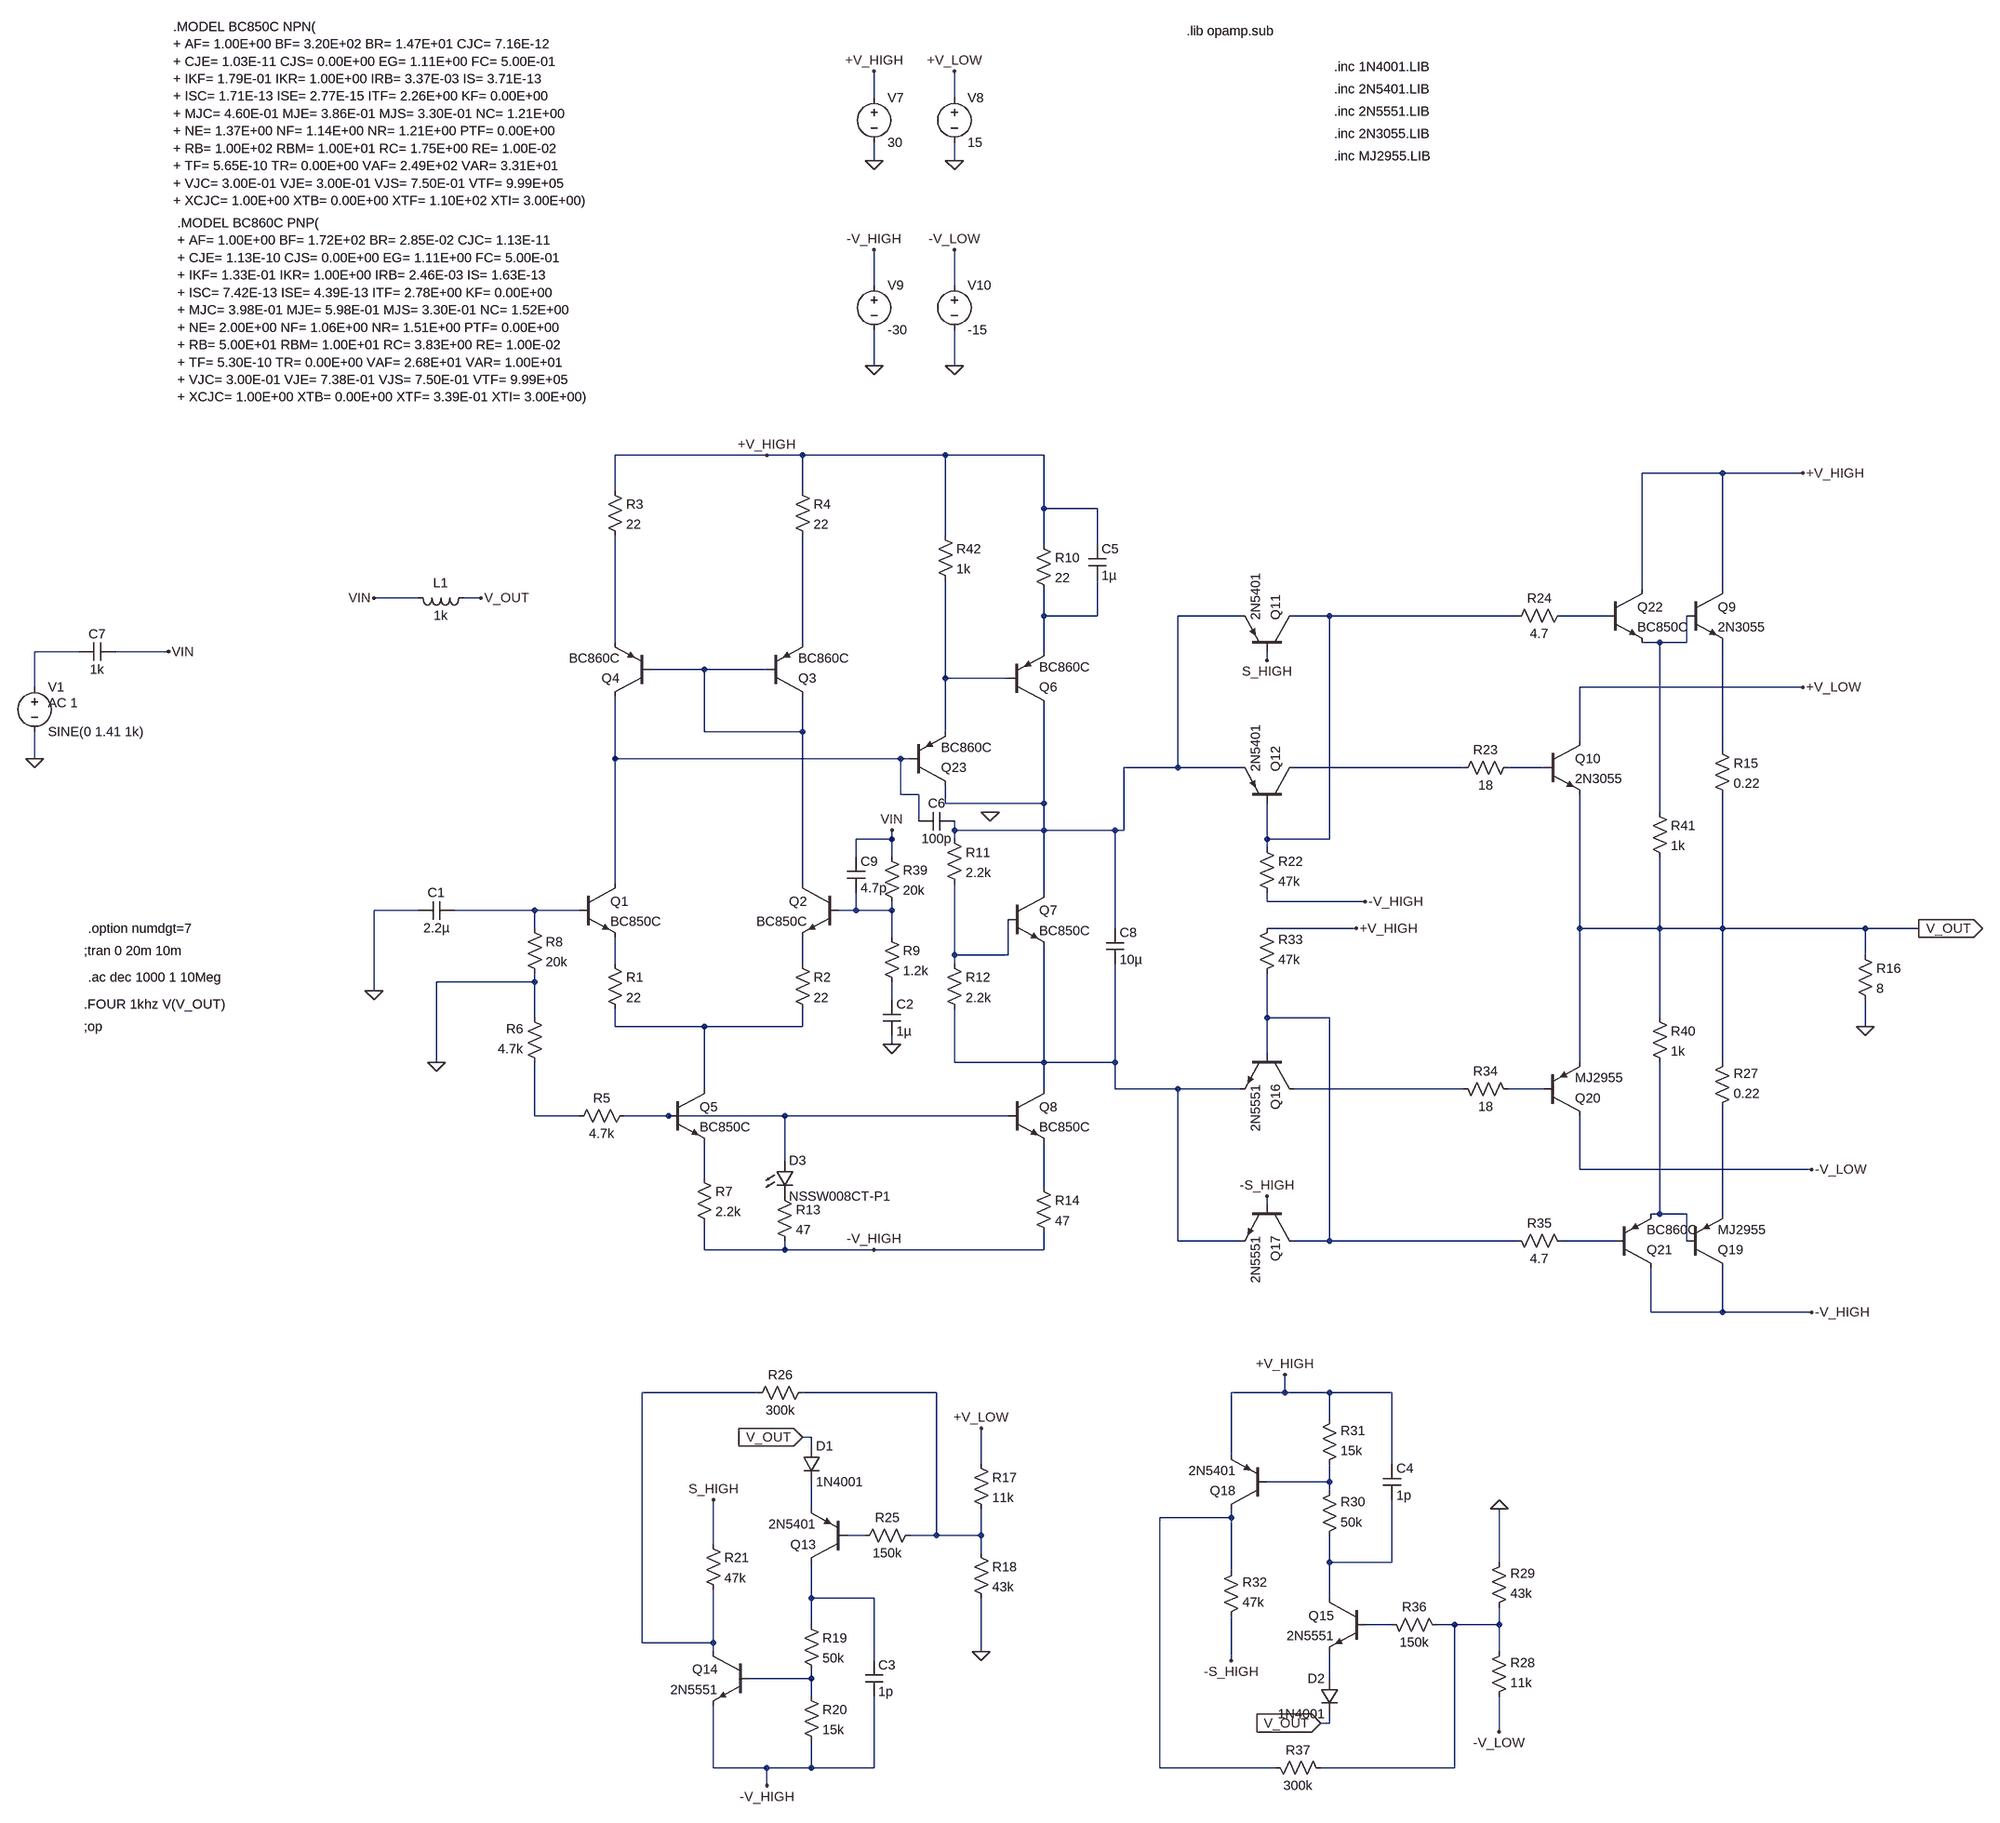
[diagram p0: schematic analisis_compensacion.asc]
analisis_compensacion.asc, the LTspice schematic file:
Version 4
SHEET 1 4340 2796
WIRE 512 -1264 512 -1312
WIRE 656 -1264 656 -1312
WIRE 512 -1152 512 -1184
WIRE 656 -1152 656 -1184
WIRE 512 -928 512 -992
WIRE 656 -928 656 -992
WIRE 512 -784 512 -848
WIRE 656 -784 656 -848
WIRE 320 -624 48 -624
WIRE 384 -624 320 -624
WIRE 640 -624 384 -624
WIRE 816 -624 640 -624
WIRE 2032 -592 1888 -592
WIRE 2176 -592 2032 -592
WIRE 48 -560 48 -624
WIRE 384 -560 384 -624
WIRE 816 -528 816 -624
WIRE 912 -528 816 -528
WIRE 640 -480 640 -624
WIRE 816 -464 816 -528
WIRE 912 -464 912 -528
WIRE 1888 -384 1888 -592
WIRE 2032 -384 2032 -592
WIRE -304 -368 -384 -368
WIRE -192 -368 -224 -368
WIRE 816 -336 816 -384
WIRE 912 -336 912 -400
WIRE 912 -336 816 -336
WIRE 1168 -336 1056 -336
WIRE 1328 -336 1264 -336
WIRE 1664 -336 1328 -336
WIRE 1824 -336 1744 -336
WIRE 48 -288 48 -480
WIRE 384 -288 384 -480
WIRE 1920 -288 1888 -288
WIRE 1968 -288 1968 -336
WIRE 1968 -288 1920 -288
WIRE -912 -272 -992 -272
WIRE -752 -272 -848 -272
WIRE 816 -272 816 -336
WIRE 1216 -256 1216 -272
WIRE 208 -240 112 -240
WIRE 320 -240 208 -240
WIRE 640 -224 640 -400
WIRE 752 -224 640 -224
WIRE -992 -208 -992 -272
WIRE 2176 -208 1776 -208
WIRE 208 -128 208 -240
WIRE 384 -128 384 -192
WIRE 384 -128 208 -128
WIRE 640 -128 640 -224
WIRE 1776 -112 1776 -208
WIRE 2032 -96 2032 -288
WIRE -992 -80 -992 -128
WIRE 48 -80 48 -192
WIRE 560 -80 48 -80
WIRE 576 -80 560 -80
WIRE 1056 -64 1056 -336
WIRE 1056 -64 960 -64
WIRE 1168 -64 1056 -64
WIRE 1568 -64 1264 -64
WIRE 1712 -64 1648 -64
WIRE 560 -16 560 -80
WIRE 592 -16 560 -16
WIRE 640 0 640 -32
WIRE 816 0 816 -176
WIRE 816 0 640 0
WIRE 1920 16 1920 -288
WIRE 592 32 592 -16
WIRE 656 48 656 32
WIRE 816 48 816 0
WIRE 816 48 656 48
WIRE 944 48 816 48
WIRE 960 48 960 -64
WIRE 960 48 944 48
WIRE 544 64 544 48
WIRE 544 64 480 64
WIRE 656 64 656 48
WIRE 1216 64 1216 0
WIRE 1328 64 1328 -336
WIRE 1328 64 1216 64
WIRE 1216 80 1216 64
WIRE 480 96 480 64
WIRE 544 96 544 64
WIRE 48 144 48 -80
WIRE 384 144 384 -128
WIRE 816 160 816 48
WIRE 1216 176 1216 160
WIRE 1392 176 1216 176
WIRE -304 192 -384 192
WIRE -96 192 -240 192
WIRE -16 192 -96 192
WIRE 480 192 480 160
WIRE 480 192 448 192
WIRE 544 192 544 176
WIRE 544 192 480 192
WIRE -96 224 -96 192
WIRE 944 224 944 48
WIRE 1376 224 1216 224
WIRE 1776 224 1776 -16
WIRE 1920 224 1920 96
WIRE 1920 224 1776 224
WIRE 2032 224 2032 -16
WIRE 2032 224 1920 224
WIRE 2288 224 2032 224
WIRE 2384 224 2288 224
WIRE 544 240 544 192
WIRE 656 272 656 144
WIRE 752 272 752 208
WIRE 752 272 656 272
WIRE 2288 272 2288 224
WIRE 48 288 48 240
WIRE 384 288 384 240
WIRE 656 288 656 272
WIRE -96 320 -96 304
WIRE -96 320 -272 320
WIRE -384 336 -384 192
WIRE 544 352 544 320
WIRE -96 384 -96 320
WIRE 1216 384 1216 304
WIRE 1328 384 1216 384
WIRE 1920 384 1920 224
WIRE 48 400 48 368
WIRE 208 400 48 400
WIRE 384 400 384 368
WIRE 384 400 208 400
WIRE 2288 400 2288 352
WIRE 544 432 544 416
WIRE 1216 448 1216 384
WIRE -272 464 -272 320
WIRE 656 464 656 368
WIRE 816 464 816 256
WIRE 816 464 656 464
WIRE 944 464 944 288
WIRE 944 464 816 464
WIRE 1776 464 1776 224
WIRE 2032 464 2032 224
WIRE 208 512 208 400
WIRE 816 512 816 464
WIRE 944 512 944 464
WIRE 1056 512 944 512
WIRE 1168 512 1056 512
WIRE 1568 512 1264 512
WIRE 1712 512 1648 512
WIRE -96 560 -96 464
WIRE -16 560 -96 560
WIRE 144 560 64 560
WIRE 352 560 144 560
WIRE 752 560 352 560
WIRE 352 640 352 560
WIRE 1776 656 1776 560
WIRE 2192 656 1776 656
WIRE 208 672 208 608
WIRE 816 688 816 608
WIRE 1216 720 1216 704
WIRE 1920 736 1920 464
WIRE 1920 736 1904 736
WIRE 1968 736 1920 736
WIRE 2032 736 2032 544
WIRE 1056 784 1056 512
WIRE 1168 784 1056 784
WIRE 1328 784 1328 384
WIRE 1328 784 1264 784
WIRE 1664 784 1328 784
WIRE 1840 784 1744 784
WIRE 1968 784 1968 736
WIRE 208 800 208 752
WIRE 352 800 352 784
WIRE 352 800 208 800
WIRE 512 800 352 800
WIRE 816 800 816 768
WIRE 816 800 512 800
WIRE 1904 912 1904 832
WIRE 2032 912 2032 832
WIRE 2032 912 1904 912
WIRE 2192 912 2032 912
WIRE 304 1056 96 1056
WIRE 624 1056 384 1056
WIRE 1248 1056 1248 1024
WIRE 1248 1056 1152 1056
WIRE 1328 1056 1248 1056
WIRE 1440 1056 1328 1056
WIRE 1328 1104 1328 1056
WIRE 400 1136 384 1136
WIRE 400 1152 400 1136
WIRE 1152 1168 1152 1056
WIRE 704 1184 704 1120
WIRE 1440 1184 1440 1056
WIRE 1328 1216 1328 1184
WIRE 1328 1216 1216 1216
WIRE 1328 1232 1328 1216
WIRE 400 1264 400 1216
WIRE 1152 1280 1152 1264
WIRE 1152 1280 1024 1280
WIRE 496 1312 464 1312
WIRE 624 1312 624 1056
WIRE 624 1312 576 1312
WIRE 704 1312 704 1264
WIRE 704 1312 624 1312
WIRE 224 1328 224 1248
WIRE 704 1344 704 1312
WIRE 1328 1360 1328 1312
WIRE 1440 1360 1440 1248
WIRE 1440 1360 1328 1360
WIRE 1632 1360 1632 1264
WIRE 1152 1376 1152 1280
WIRE 400 1424 400 1360
WIRE 512 1424 400 1424
WIRE 1328 1424 1328 1360
WIRE 400 1472 400 1424
WIRE 1440 1472 1392 1472
WIRE 1552 1472 1520 1472
WIRE 1632 1472 1632 1440
WIRE 1632 1472 1552 1472
WIRE 96 1504 96 1056
WIRE 224 1504 224 1408
WIRE 224 1504 96 1504
WIRE 224 1520 224 1504
WIRE 704 1520 704 1424
WIRE 1632 1520 1632 1472
WIRE 512 1536 512 1424
WIRE 1152 1536 1152 1456
WIRE 400 1568 400 1552
WIRE 400 1568 288 1568
WIRE 1328 1568 1328 1520
WIRE 400 1600 400 1568
WIRE 1328 1648 1328 1632
WIRE 1328 1648 1312 1648
WIRE 1632 1664 1632 1600
WIRE 224 1728 224 1616
WIRE 320 1728 224 1728
WIRE 400 1728 400 1680
WIRE 400 1728 320 1728
WIRE 512 1728 512 1600
WIRE 512 1728 400 1728
WIRE 1024 1728 1024 1280
WIRE 1232 1728 1024 1728
WIRE 1552 1728 1552 1472
WIRE 1552 1728 1312 1728
WIRE 320 1760 320 1728
FLAG -272 464 0
FLAG 544 432 0
FLAG -384 336 0
FLAG 2176 -592 +V_HIGH
FLAG 2176 -208 +V_LOW
FLAG 2288 400 0
FLAG 704 1520 0
FLAG 704 1120 +V_LOW
FLAG 2384 224 V_OUT
IOPIN 2384 224 Out
FLAG 384 1136 V_OUT
IOPIN 384 1136 In
FLAG 320 1760 -V_HIGH
FLAG 1216 -256 S_HIGH
FLAG 224 1248 S_HIGH
FLAG 1392 176 -V_HIGH
FLAG 2192 912 -V_HIGH
FLAG 2192 656 -V_LOW
FLAG 1632 1264 0
FLAG 1632 1664 -V_LOW
FLAG 1312 1648 V_OUT
IOPIN 1312 1648 In
FLAG 1248 1024 +V_HIGH
FLAG 1216 704 -S_HIGH
FLAG 1152 1536 -S_HIGH
FLAG 1376 224 +V_HIGH
FLAG 512 -1152 0
FLAG 656 -1152 0
FLAG 512 -1312 +V_HIGH
FLAG 656 -1312 +V_LOW
FLAG 512 -784 0
FLAG 656 -784 0
FLAG 512 -992 -V_HIGH
FLAG 656 -992 -V_LOW
FLAG 320 -624 +V_HIGH
FLAG 512 800 -V_HIGH
FLAG 720 16 0
FLAG 544 48 VIN
FLAG -384 -368 VIN
FLAG -192 -368 V_OUT
FLAG -752 -272 VIN
FLAG -992 -80 0
DATAFLAG 2288 224 ""
SYMBOL npn -16 144 R0
SYMATTR InstName Q1
SYMATTR Value BC850C
SYMBOL npn 448 144 M0
SYMATTR InstName Q2
SYMATTR Value BC850C
SYMBOL pnp 320 -192 M180
SYMATTR InstName Q3
SYMATTR Value BC860C
SYMBOL pnp 112 -192 R180
SYMATTR InstName Q4
SYMATTR Value BC860C
SYMBOL res 32 272 R0
SYMATTR InstName R1
SYMATTR Value 22
SYMBOL res 368 272 R0
SYMATTR InstName R2
SYMATTR Value 22
SYMBOL res 32 -576 R0
SYMATTR InstName R3
SYMATTR Value 22
SYMBOL res 368 -576 R0
SYMATTR InstName R4
SYMATTR Value 22
SYMBOL npn 144 512 R0
SYMATTR InstName Q5
SYMATTR Value BC850C
SYMBOL res 80 544 R90
WINDOW 0 0 56 VBottom 2
WINDOW 3 32 56 VTop 2
SYMATTR InstName R5
SYMATTR Value 4.7k
SYMBOL res -80 480 R180
WINDOW 0 36 76 Left 2
WINDOW 3 36 40 Left 2
SYMATTR InstName R6
SYMATTR Value 4.7k
SYMBOL res 192 656 R0
SYMATTR InstName R7
SYMATTR Value 2.2k
SYMBOL res -112 208 R0
SYMATTR InstName R8
SYMATTR Value 20k
SYMBOL res 528 224 R0
SYMATTR InstName R9
SYMATTR Value 1.2k
SYMBOL cap -240 176 R90
WINDOW 0 0 32 VBottom 2
WINDOW 3 32 32 VTop 2
SYMATTR InstName C1
SYMATTR Value 2.2µ
SYMBOL pnp 752 -176 M180
SYMATTR InstName Q6
SYMATTR Value BC860C
SYMBOL res 800 -480 R0
SYMATTR InstName R10
SYMATTR Value 22
SYMBOL npn 752 160 R0
SYMATTR InstName Q7
SYMATTR Value BC850C
SYMBOL res 640 48 R0
SYMATTR InstName R11
SYMATTR Value 2.2k
SYMBOL res 640 272 R0
SYMATTR InstName R12
SYMATTR Value 2.2k
SYMBOL npn 752 512 R0
SYMATTR InstName Q8
SYMATTR Value BC850C
SYMBOL res 800 672 R0
SYMATTR InstName R14
SYMATTR Value 47
SYMBOL cap 528 352 R0
SYMATTR InstName C2
SYMATTR Value 1µ
SYMBOL npn 1968 -384 R0
SYMATTR InstName Q9
SYMATTR Value 2N3055
SYMBOL npn 1712 -112 R0
SYMATTR InstName Q10
SYMATTR Value 2N3055
SYMBOL res 2016 -112 R0
SYMATTR InstName R15
SYMATTR Value 0.22
SYMBOL pnp 1264 -272 M270
SYMATTR InstName Q11
SYMATTR Value 2N5401
SYMBOL pnp 1264 0 M270
SYMATTR InstName Q12
SYMATTR Value 2N5401
SYMBOL res 2272 256 R0
SYMATTR InstName R16
SYMATTR Value 8
SYMBOL res 688 1168 R0
SYMATTR InstName R17
SYMATTR Value 11k
SYMBOL res 688 1328 R0
SYMATTR InstName R18
SYMATTR Value 43k
SYMBOL pnp 464 1360 R180
SYMATTR InstName Q13
SYMATTR Value 2N5401
SYMBOL res 384 1456 R0
SYMATTR InstName R19
SYMATTR Value 50k
SYMBOL res 384 1584 R0
SYMATTR InstName R20
SYMATTR Value 15k
SYMBOL npn 288 1520 M0
SYMATTR InstName Q14
SYMATTR Value 2N5551
SYMBOL res 208 1312 R0
SYMATTR InstName R21
SYMATTR Value 47k
SYMBOL res 1200 64 R0
SYMATTR InstName R22
SYMATTR Value 47k
SYMBOL cap 496 1536 R0
SYMATTR InstName C3
SYMATTR Value 1p
SYMBOL diode 384 1152 R0
SYMATTR InstName D1
SYMATTR Value 1N4001
SYMBOL res 1664 -80 R90
WINDOW 0 0 56 VBottom 2
WINDOW 3 32 56 VTop 2
SYMATTR InstName R23
SYMATTR Value 18
SYMBOL res 1760 -352 R90
WINDOW 0 0 56 VBottom 2
WINDOW 3 32 56 VTop 2
SYMATTR InstName R24
SYMATTR Value 4.7
SYMBOL res 592 1296 R90
WINDOW 0 0 56 VBottom 2
WINDOW 3 32 56 VTop 2
SYMATTR InstName R25
SYMATTR Value 150k
SYMBOL res 400 1040 R90
WINDOW 0 0 56 VBottom 2
WINDOW 3 32 56 VTop 2
SYMATTR InstName R26
SYMATTR Value 300k
SYMBOL res 2016 560 M180
WINDOW 0 36 76 Left 2
WINDOW 3 36 40 Left 2
SYMATTR InstName R27
SYMATTR Value 0.22
SYMBOL res 1616 1616 M180
WINDOW 0 36 76 Left 2
WINDOW 3 36 40 Left 2
SYMATTR InstName R28
SYMATTR Value 11k
SYMBOL res 1616 1456 M180
WINDOW 0 36 76 Left 2
WINDOW 3 36 40 Left 2
SYMATTR InstName R29
SYMATTR Value 43k
SYMBOL res 1312 1328 M180
WINDOW 0 36 76 Left 2
WINDOW 3 36 40 Left 2
SYMATTR InstName R30
SYMATTR Value 50k
SYMBOL res 1312 1200 M180
WINDOW 0 36 76 Left 2
WINDOW 3 36 40 Left 2
SYMATTR InstName R31
SYMATTR Value 15k
SYMBOL res 1136 1472 M180
WINDOW 0 36 76 Left 2
WINDOW 3 36 40 Left 2
SYMATTR InstName R32
SYMATTR Value 47k
SYMBOL res 1200 320 M180
WINDOW 0 36 76 Left 2
WINDOW 3 36 40 Left 2
SYMATTR InstName R33
SYMATTR Value 47k
SYMBOL cap 1424 1248 M180
WINDOW 0 24 56 Left 2
WINDOW 3 24 8 Left 2
SYMATTR InstName C4
SYMATTR Value 1p
SYMBOL diode 1344 1568 M0
SYMATTR InstName D2
SYMATTR Value 1N4001
SYMBOL res 1664 528 M270
WINDOW 0 32 56 VTop 2
WINDOW 3 0 56 VBottom 2
SYMATTR InstName R34
SYMATTR Value 18
SYMBOL res 1760 800 M270
WINDOW 0 32 56 VTop 2
WINDOW 3 0 56 VBottom 2
SYMATTR InstName R35
SYMATTR Value 4.7
SYMBOL res 1536 1488 M270
WINDOW 0 32 56 VTop 2
WINDOW 3 0 56 VBottom 2
SYMATTR InstName R36
SYMATTR Value 150k
SYMBOL res 1328 1744 M270
WINDOW 0 32 56 VTop 2
WINDOW 3 0 56 VBottom 2
SYMATTR InstName R37
SYMATTR Value 300k
SYMBOL npn 1392 1424 M0
SYMATTR InstName Q15
SYMATTR Value 2N5551
SYMBOL npn 1264 448 R90
SYMATTR InstName Q16
SYMATTR Value 2N5551
SYMBOL npn 1264 720 R90
SYMATTR InstName Q17
SYMATTR Value 2N5551
SYMBOL pnp 1216 1264 R180
SYMATTR InstName Q18
SYMATTR Value 2N5401
SYMBOL pnp 1968 832 M180
SYMATTR InstName Q19
SYMATTR Value MJ2955
SYMBOL pnp 1712 560 M180
SYMATTR InstName Q20
SYMATTR Value MJ2955
SYMBOL voltage 512 -1280 R0
WINDOW 123 0 0 Left 0
WINDOW 39 0 0 Left 0
SYMATTR InstName V7
SYMATTR Value 30
SYMBOL voltage 656 -1280 R0
WINDOW 123 0 0 Left 0
WINDOW 39 0 0 Left 0
SYMATTR InstName V8
SYMATTR Value 15
SYMBOL voltage 512 -944 R0
WINDOW 123 0 0 Left 0
WINDOW 39 0 0 Left 0
SYMATTR InstName V9
SYMATTR Value -30
SYMBOL voltage 656 -944 R0
WINDOW 123 0 0 Left 0
WINDOW 39 0 0 Left 0
SYMATTR InstName V10
SYMATTR Value -15
SYMBOL res 528 80 R0
SYMATTR InstName R39
SYMATTR Value 20k
SYMBOL LED 336 640 R0
SYMATTR InstName D3
SYMATTR Value NSSW008CT-P1
SYMBOL cap 896 -464 R0
SYMATTR InstName C5
SYMATTR Value 1µ
SYMBOL pnp 1840 832 M180
SYMATTR InstName Q21
SYMATTR Value BC860C
SYMBOL res 1904 368 R0
SYMATTR InstName R40
SYMATTR Value 1k
SYMBOL npn 1824 -384 R0
SYMATTR InstName Q22
SYMATTR Value BC850C
SYMBOL res 1904 0 R0
SYMATTR InstName R41
SYMATTR Value 1k
SYMBOL res 336 688 R0
SYMATTR InstName R13
SYMATTR Value 47
SYMBOL pnp 576 -32 M180
SYMATTR InstName Q23
SYMATTR Value BC860C
SYMBOL res 624 -496 R0
SYMATTR InstName R42
SYMATTR Value 1k
SYMBOL cap 656 16 R90
WINDOW 0 0 32 VBottom 2
WINDOW 3 32 32 VTop 2
SYMATTR InstName C6
SYMATTR Value 100p
SYMBOL cap 928 224 R0
SYMATTR InstName C8
SYMATTR Value 10µ
SYMBOL ind -208 -384 R90
WINDOW 0 5 56 VBottom 2
WINDOW 3 32 56 VTop 2
SYMATTR InstName L1
SYMATTR Value 1k
SYMBOL voltage -992 -224 R0
WINDOW 123 24 44 Left 2
WINDOW 39 0 0 Left 0
SYMATTR InstName V1
SYMATTR Value SINE(0 1.41 1k)
SYMATTR Value2 AC 1
SYMBOL cap -848 -288 R90
WINDOW 0 0 32 VBottom 2
WINDOW 3 32 32 VTop 2
SYMATTR InstName C7
SYMATTR Value 1k
SYMBOL cap 464 96 R0
SYMATTR InstName C9
SYMATTR Value 4.7p
TEXT -904 264 Left 2 !;tran 0 20m 10m
TEXT -904 360 Left 2 !.FOUR 1khz V(V_OUT)
TEXT 1336 -1160 Left 2 !.inc MJ2955.LIB
TEXT 1336 -1200 Left 2 !.inc 2N3055.LIB
TEXT 1336 -1240 Left 2 !.inc 2N5551.LIB
TEXT 1336 -1280 Left 2 !.inc 2N5401.LIB
TEXT 1336 -1320 Left 2 !.inc 1N4001.LIB
TEXT -744 -1392 Left 2 !.MODEL BC850C NPN(\n+ AF= 1.00E+00 BF= 3.20E+02 BR= 1.47E+01 CJC= 7.16E-12\n+ CJE= 1.03E-11 CJS= 0.00E+00 EG= 1.11E+00 FC= 5.00E-01\n+ IKF= 1.79E-01 IKR= 1.00E+00 IRB= 3.37E-03 IS= 3.71E-13\n+ ISC= 1.71E-13 ISE= 2.77E-15 ITF= 2.26E+00 KF= 0.00E+00\n+ MJC= 4.60E-01 MJE= 3.86E-01 MJS= 3.30E-01 NC= 1.21E+00\n+ NE= 1.37E+00 NF= 1.14E+00 NR= 1.21E+00 PTF= 0.00E+00\n+ RB= 1.00E+02 RBM= 1.00E+01 RC= 1.75E+00 RE= 1.00E-02\n+ TF= 5.65E-10 TR= 0.00E+00 VAF= 2.49E+02 VAR= 3.31E+01\n+ VJC= 3.00E-01 VJE= 3.00E-01 VJS= 7.50E-01 VTF= 9.99E+05\n+ XCJC= 1.00E+00 XTB= 0.00E+00 XTF= 1.10E+02 XTI= 3.00E+00)
TEXT -736 -1040 Left 2 !.MODEL BC860C PNP(\n+ AF= 1.00E+00 BF= 1.72E+02 BR= 2.85E-02 CJC= 1.13E-11\n+ CJE= 1.13E-10 CJS= 0.00E+00 EG= 1.11E+00 FC= 5.00E-01\n+ IKF= 1.33E-01 IKR= 1.00E+00 IRB= 2.46E-03 IS= 1.63E-13\n+ ISC= 7.42E-13 ISE= 4.39E-13 ITF= 2.78E+00 KF= 0.00E+00\n+ MJC= 3.98E-01 MJE= 5.98E-01 MJS= 3.30E-01 NC= 1.52E+00\n+ NE= 2.00E+00 NF= 1.06E+00 NR= 1.51E+00 PTF= 0.00E+00\n+ RB= 5.00E+01 RBM= 1.00E+01 RC= 3.83E+00 RE= 1.00E-02\n+ TF= 5.30E-10 TR= 0.00E+00 VAF= 2.68E+01 VAR= 1.00E+01\n+ VJC= 3.00E-01 VJE= 7.38E-01 VJS= 7.50E-01 VTF= 9.99E+05\n+ XCJC= 1.00E+00 XTB= 0.00E+00 XTF= 3.39E-01 XTI= 3.00E+00)
TEXT 1072 -1384 Left 2 !.lib opamp.sub
TEXT -896 312 Left 2 !.ac dec 1000 1 10Meg
TEXT -904 400 Left 2 !;op
TEXT -896 224 Left 2 !.option numdgt=7

The netlist it stands for:
* analisis_compensacion.asc
Q1 N012 N015 N018 0 BC850C
Q2 N009 N016 N019 0 BC850C
Q3 N009 N009 N006 0 BC860C
Q4 N012 N009 N005 0 BC860C
R1 N018 N022 22
R2 N019 N022 22
R3 +V_HIGH N005 22
R4 +V_HIGH N006 22
Q5 N022 N027 N028 0 BC850C
R5 N027 N026 4.7k
R6 N026 0 4.7k
R7 N028 -V_HIGH 2.2k
R8 N015 0 20k
R9 N016 N020 1.2k
C1 N015 0 2.2µ
Q6 N002 N010 N001 0 BC860C
R10 +V_HIGH N001 22
Q7 N002 N017 N023 0 BC850C
R11 N002 N017 2.2k
R12 N017 N023 2.2k
Q8 N023 N027 N029 0 BC850C
R14 N029 -V_HIGH 47
C2 N020 0 1µ
Q9 +V_HIGH N007 N011 0 2N3055
Q10 +V_LOW N014 V_OUT 0 2N3055
R15 N011 V_OUT 0.22
Q11 N003 S_HIGH N002 0 2N5401
Q12 N013 N003 N002 0 2N5401
R16 V_OUT 0 8
R17 +V_LOW N034 11k
R18 N034 0 43k
Q13 N040 N038 N036 0 2N5401
R19 N040 N043 50k
R20 N043 -V_HIGH 15k
Q14 N033 N043 -V_HIGH 0 2N5551
R21 S_HIGH N033 47k
R22 N003 -V_HIGH 47k
C3 N040 -V_HIGH 1p
D1 V_OUT N036 1N4001
R23 N014 N013 18
R24 N004 N003 4.7
R25 N034 N038 150k
R26 N034 N033 300k
R27 N031 V_OUT 0.22
R28 -V_LOW N042 11k
R29 N042 0 43k
R30 N039 N035 50k
R31 N035 +V_HIGH 15k
R32 -S_HIGH N037 47k
R33 N021 +V_HIGH 47k
C4 N039 +V_HIGH 1p
D2 N044 V_OUT 1N4001
R34 N025 N024 18
R35 N032 N021 4.7
R36 N042 N041 150k
R37 N042 N037 300k
Q15 N039 N041 N044 0 2N5551
Q16 N024 N021 N023 0 2N5551
Q17 N021 -S_HIGH N023 0 2N5551
Q18 N037 N035 +V_HIGH 0 2N5401
Q19 -V_HIGH N030 N031 0 MJ2955
Q20 -V_LOW N025 V_OUT 0 MJ2955
V7 +V_HIGH 0 30
V8 +V_LOW 0 15
V9 -V_HIGH 0 -30
V10 -V_LOW 0 -15
R39 VIN N016 20k
D3 N027 P001 NSSW008CT-P1
C5 +V_HIGH N001 1µ
Q21 -V_HIGH N032 N030 0 BC860C
R40 V_OUT N030 1k
Q22 +V_HIGH N004 N007 0 BC850C
R41 N007 V_OUT 1k
R13 P001 -V_HIGH 47
Q23 N002 N012 N010 0 BC860C
R42 +V_HIGH N010 1k
C6 N002 N012 100p
C8 N002 N023 10µ
L1 V_OUT VIN 1k
V1 N008 0 SINE(0 1.41 1k) AC 1
C7 VIN N008 1k
C9 VIN N016 4.7p
.model D D
.lib standard.dio
.model NPN NPN
.model PNP PNP
.lib standard.bjt
;tran 0 20m 10m
.FOUR 1khz V(V_OUT)
.inc MJ2955.LIB
.inc 2N3055.LIB
.inc 2N5551.LIB
.inc 2N5401.LIB
.inc 1N4001.LIB
.MODEL BC850C NPN(
+ AF= 1.00E+00 BF= 3.20E+02 BR= 1.47E+01 CJC= 7.16E-12
+ CJE= 1.03E-11 CJS= 0.00E+00 EG= 1.11E+00 FC= 5.00E-01
+ IKF= 1.79E-01 IKR= 1.00E+00 IRB= 3.37E-03 IS= 3.71E-13
+ ISC= 1.71E-13 ISE= 2.77E-15 ITF= 2.26E+00 KF= 0.00E+00
+ MJC= 4.60E-01 MJE= 3.86E-01 MJS= 3.30E-01 NC= 1.21E+00
+ NE= 1.37E+00 NF= 1.14E+00 NR= 1.21E+00 PTF= 0.00E+00
+ RB= 1.00E+02 RBM= 1.00E+01 RC= 1.75E+00 RE= 1.00E-02
+ TF= 5.65E-10 TR= 0.00E+00 VAF= 2.49E+02 VAR= 3.31E+01
+ VJC= 3.00E-01 VJE= 3.00E-01 VJS= 7.50E-01 VTF= 9.99E+05
+ XCJC= 1.00E+00 XTB= 0.00E+00 XTF= 1.10E+02 XTI= 3.00E+00)
.MODEL BC860C PNP(
+ AF= 1.00E+00 BF= 1.72E+02 BR= 2.85E-02 CJC= 1.13E-11
+ CJE= 1.13E-10 CJS= 0.00E+00 EG= 1.11E+00 FC= 5.00E-01
+ IKF= 1.33E-01 IKR= 1.00E+00 IRB= 2.46E-03 IS= 1.63E-13
+ ISC= 7.42E-13 ISE= 4.39E-13 ITF= 2.78E+00 KF= 0.00E+00
+ MJC= 3.98E-01 MJE= 5.98E-01 MJS= 3.30E-01 NC= 1.52E+00
+ NE= 2.00E+00 NF= 1.06E+00 NR= 1.51E+00 PTF= 0.00E+00
+ RB= 5.00E+01 RBM= 1.00E+01 RC= 3.83E+00 RE= 1.00E-02
+ TF= 5.30E-10 TR= 0.00E+00 VAF= 2.68E+01 VAR= 1.00E+01
+ VJC= 3.00E-01 VJE= 7.38E-01 VJS= 7.50E-01 VTF= 9.99E+05
+ XCJC= 1.00E+00 XTB= 0.00E+00 XTF= 3.39E-01 XTI= 3.00E+00)
.lib opamp.sub
.ac dec 1000 1 10Meg
;op
.option numdgt=7
.backanno
.end